# EAGLE design module (EAGLE 9.6.2)

## Sheet 1 of 3
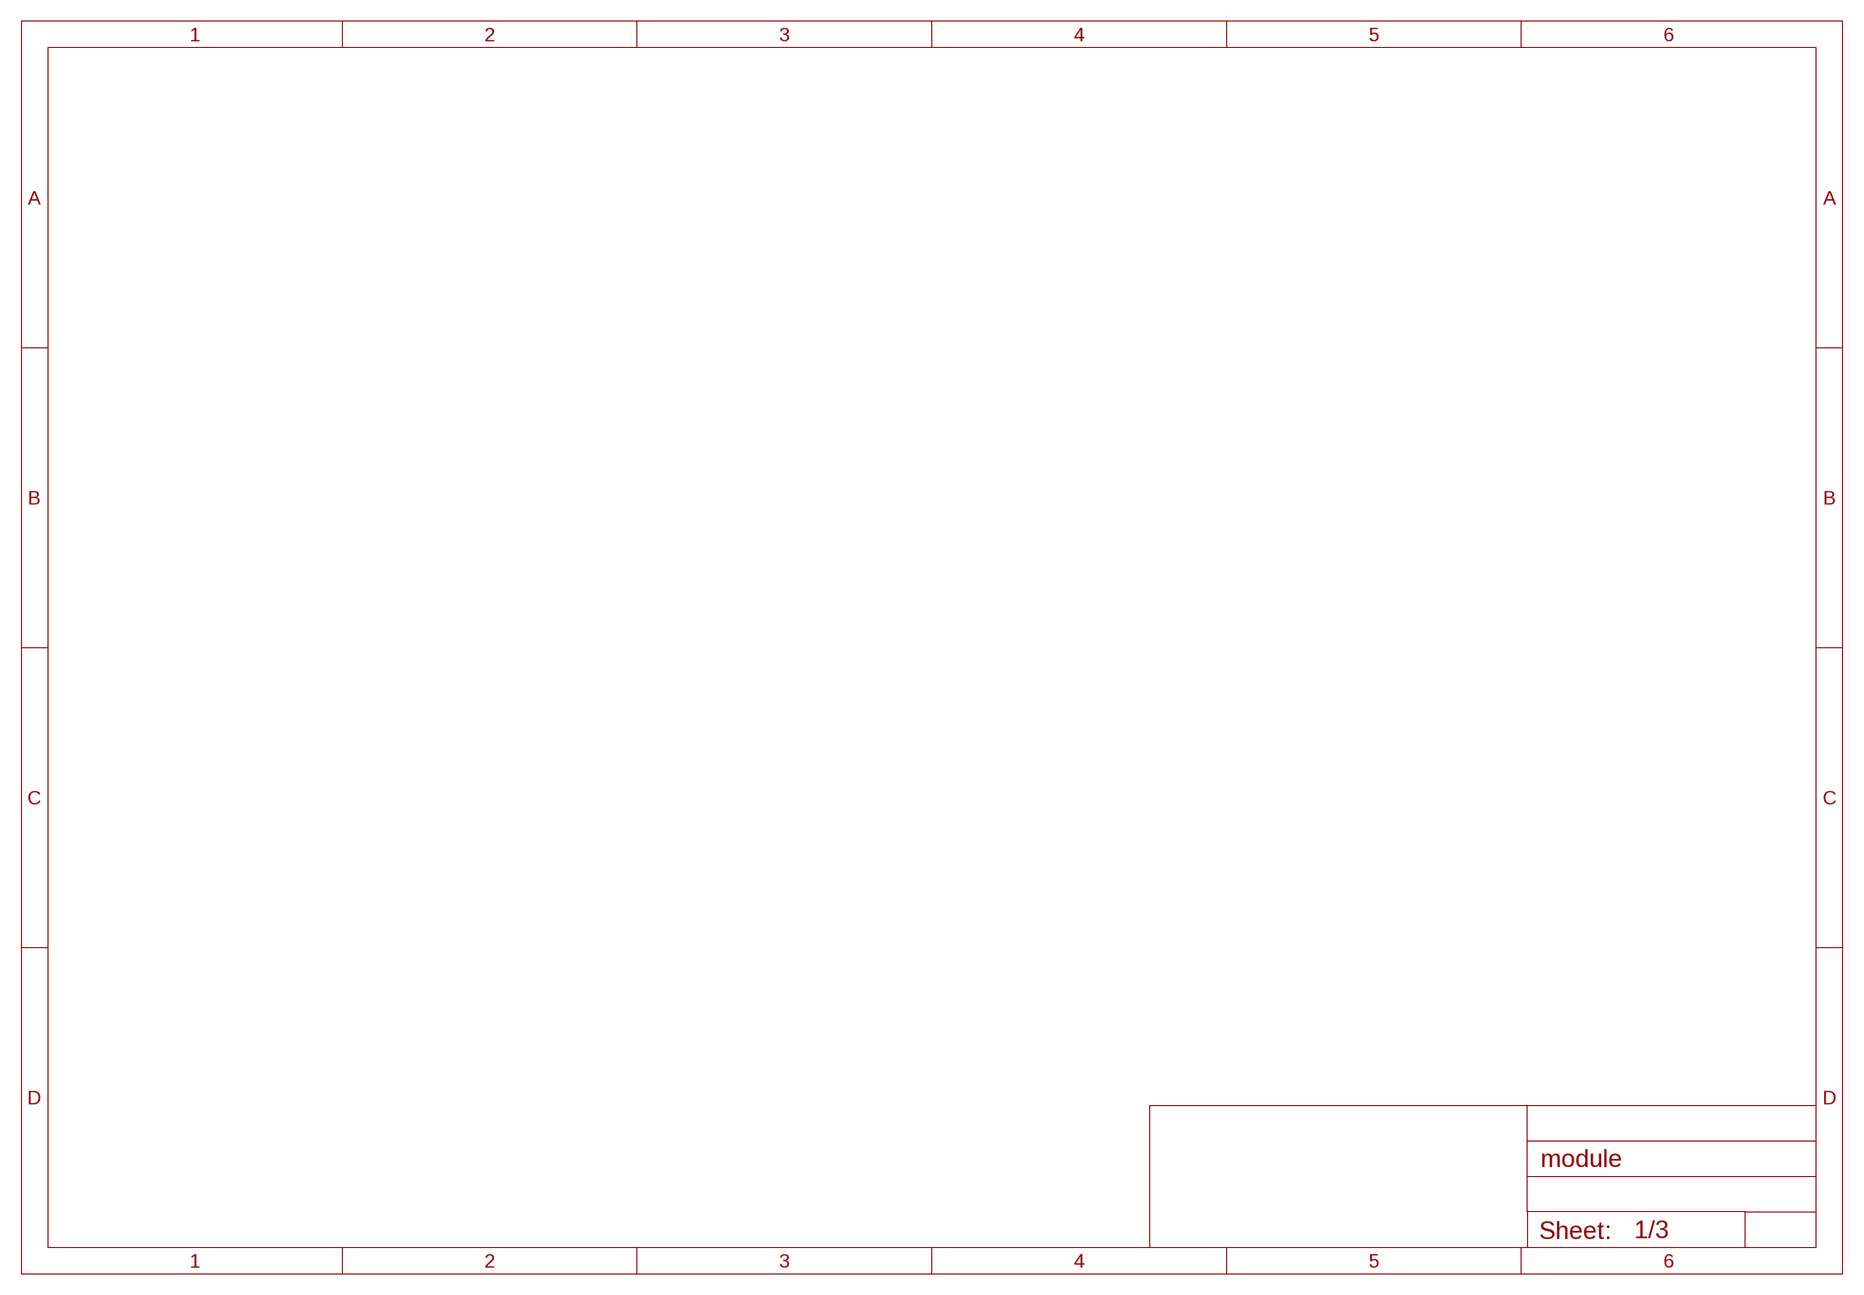
[diagram p0: schematic, sheet 1]

## Sheet 2 of 3
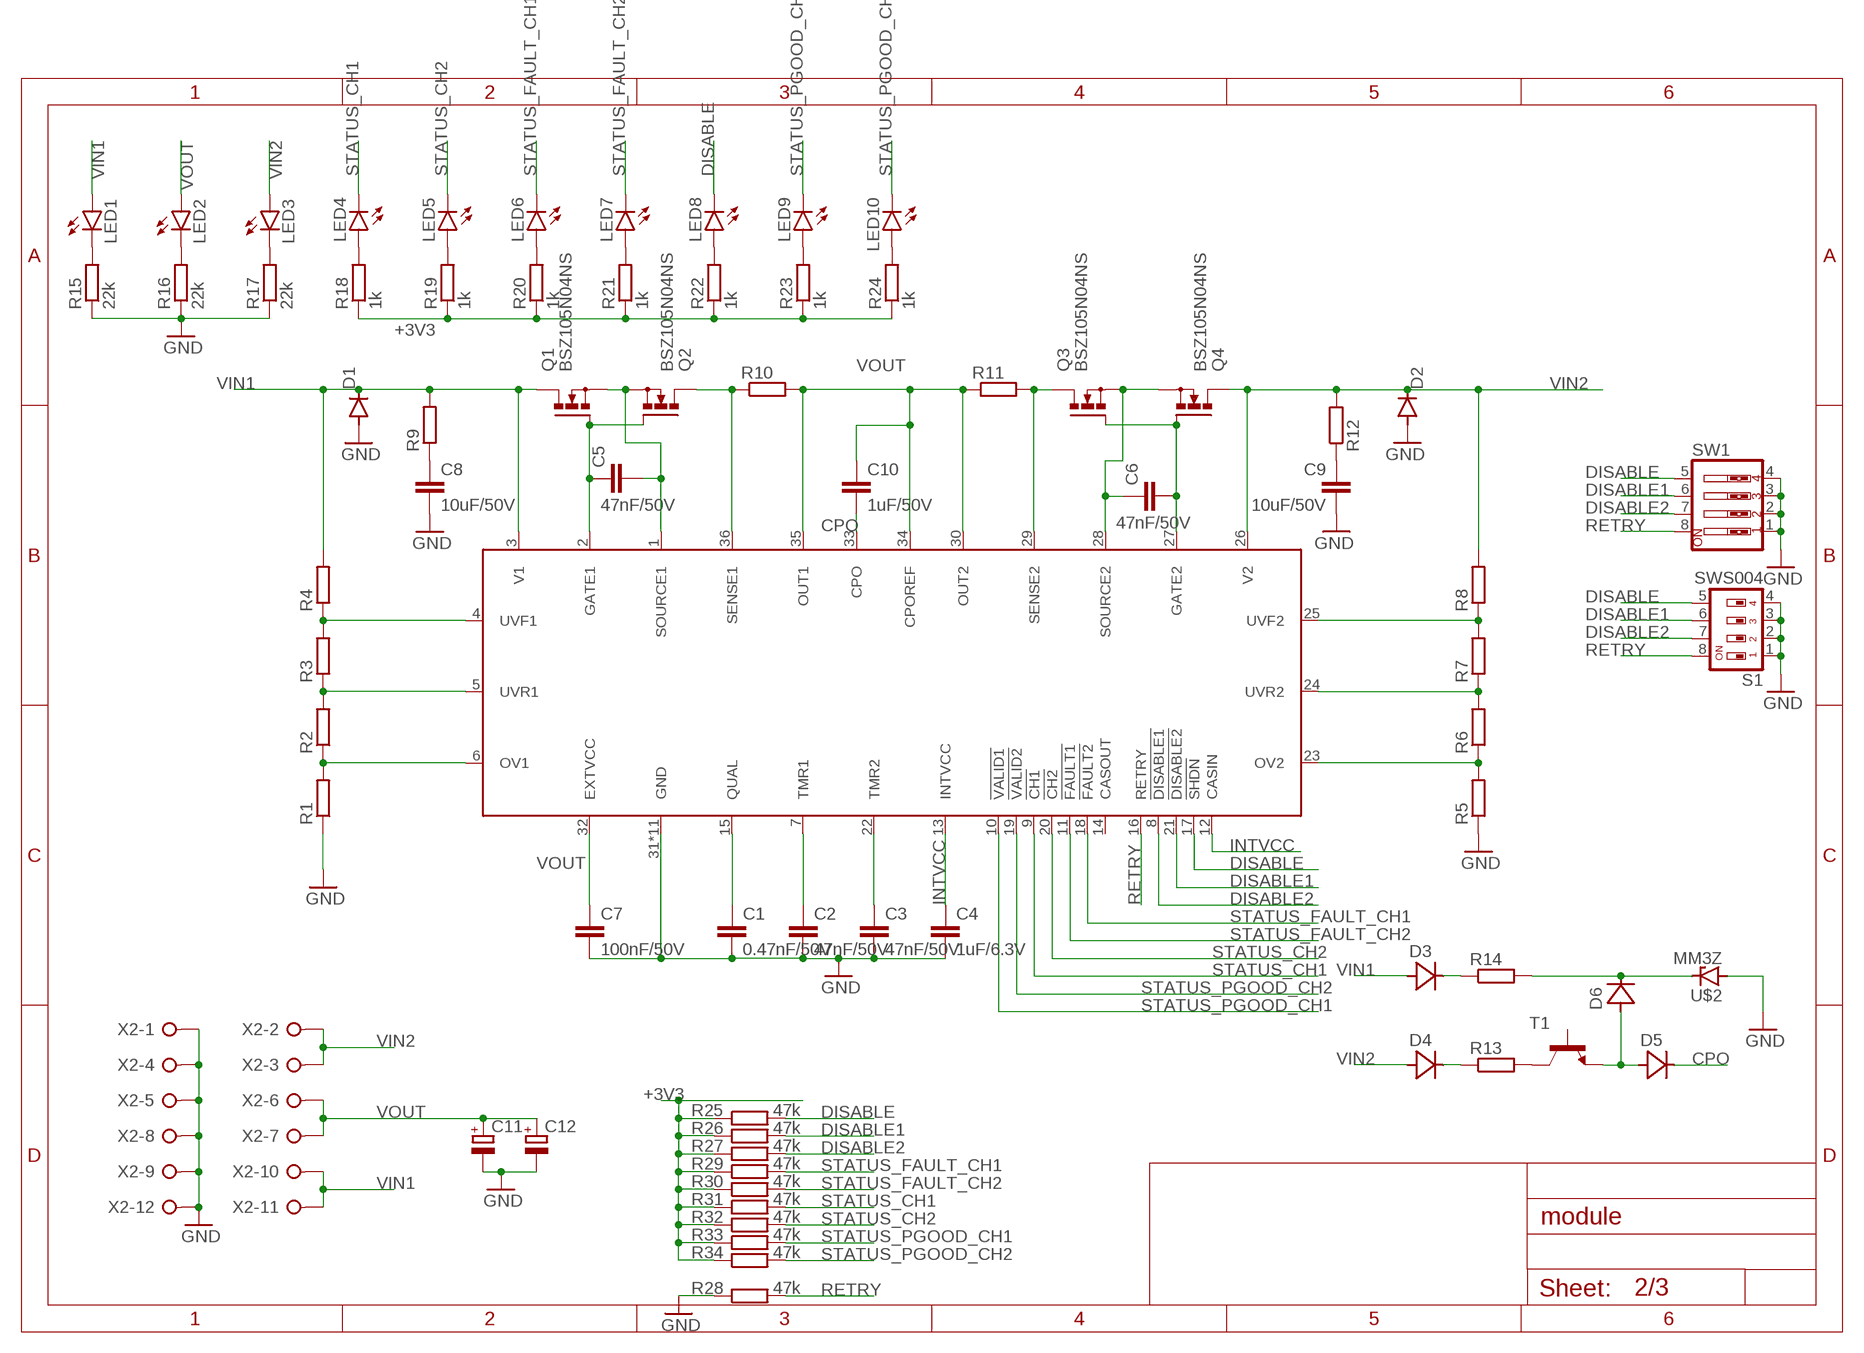
[diagram p1: schematic, sheet 2]

### Parts
C1  0.47nF/50V  C-EUC0603  [C0603]
C2  47nF/50V  C-EUC0603  [C0603]
C3  47nF/50V  C-EUC0603  [C0603]
C4  1uF/6.3V  C-EUC0603  [C0603]
C5  47nF/50V  C-EUC0603  [C0603]
C6  47nF/50V  C-EUC0603  [C0603]
C7  100nF/50V  C-EUC0603  [C0603]
C8  10uF/50V  C-EUC1206  [C1206]
C9  10uF/50V  C-EUC1206  [C1206]
C10  1uF/50V  C-EUC0805  [C0805]
C11  CPOL-EU140CLH-1010  [140CLH-1010]
C12  CPOL-EU140CLH-1010  [140CLH-1010]
D1  DIODE-DO214AC  [DO214AC]
D2  DIODE-DO214AC  [DO214AC]
D3  1N4148WS  [SOD323]
D4  1N4148WS  [SOD323]
D5  1N4148WS  [SOD323]
D6  1N4148WS  [SOD323]
LED1  LEDCHIP-LED0603  [CHIP-LED0603]
LED2  LEDCHIP-LED0603  [CHIP-LED0603]
LED3  LEDCHIP-LED0603  [CHIP-LED0603]
LED4  LEDCHIP-LED0603  [CHIP-LED0603]
LED5  LEDCHIP-LED0603  [CHIP-LED0603]
LED6  LEDCHIP-LED0603  [CHIP-LED0603]
LED7  LEDCHIP-LED0603  [CHIP-LED0603]
LED8  LEDCHIP-LED0603  [CHIP-LED0603]
LED9  LEDCHIP-LED0603  [CHIP-LED0603]
LED10  LEDCHIP-LED0603  [CHIP-LED0603]
Q1  BSZ105N04NS  [PG-TDSON-8]
Q2  BSZ105N04NS  [PG-TDSON-8]
Q3  BSZ105N04NS  [PG-TDSON-8]
Q4  BSZ105N04NS  [PG-TDSON-8]
R1  R-EU_R0603  [R0603]
R2  R-EU_R0603  [R0603]
R3  R-EU_R0603  [R0603]
R4  R-EU_R0603  [R0603]
R5  R-EU_R0603  [R0603]
R6  R-EU_R0603  [R0603]
R7  R-EU_R0603  [R0603]
R8  R-EU_R0603  [R0603]
R9  R-EU_R0603  [R0603]
R10  R-EU_R2512  [R2512]
R11  R-EU_R2512  [R2512]
R12  R-EU_R0603  [R0603]
R13  R-EU_R0603  [R0603]
R14  R-EU_R0603  [R0603]
R15  22k  R-EU_R0603  [R0603]
R16  22k  R-EU_R0603  [R0603]
R17  22k  R-EU_R0603  [R0603]
R18  1k  R-EU_R0603  [R0603]
R19  1k  R-EU_R0603  [R0603]
R20  1k  R-EU_R0603  [R0603]
R21  1k  R-EU_R0603  [R0603]
R22  1k  R-EU_R0603  [R0603]
R23  1k  R-EU_R0603  [R0603]
R24  1k  R-EU_R0603  [R0603]
R25  47k  R-EU_R0603  [R0603]
R26  47k  R-EU_R0603  [R0603]
R27  47k  R-EU_R0603  [R0603]
R28  47k  R-EU_R0603  [R0603]
R29  47k  R-EU_R0603  [R0603]
R30  47k  R-EU_R0603  [R0603]
R31  47k  R-EU_R0603  [R0603]
R32  47k  R-EU_R0603  [R0603]
R33  47k  R-EU_R0603  [R0603]
R34  47k  R-EU_R0603  [R0603]
S1  SWS004  [SMS-004]
SW1  SW_DIP-4  [EDG-04]
T1  MMBT2222ALT1-NPN-SOT23-BEC  [SOT23-BEC]
U$1  LTC4421  [QFN50P600X500X75-37T460X360N]
U$2  MM3Z  [SOD323]
X2  W237-12P  [W237-12P]

### Nets
+3V3: R18.1 R19.1 R20.1 R21.1 R22.1 R23.1 R24.1 R25.1 R26.1 R27.1 R29.1 R30.1 R31.1 R32.1 R33.1 R34.1
CPO: C10.2 D5.K(C) U$1.33(CPO)
DISABLE: LED8.C R25.2 S1.5 SW1.5 U$1.17(!SHDN)
DISABLE1: R26.2 S1.6 SW1.6 U$1.21(!DISABLE2)
DISABLE2: R27.2 S1.7 SW1.7 U$1.8(!DISABLE1)
GND: C1.2 C2.2 C3.2 C4.2 C7.2 C8.2 C9.2 C11.- C12.- D1.A D2.A R1.1 R5.1 R15.1 R16.1 R17.1 R28.1 S1.1 S1.2 S1.3 S1.4 SW1.1 SW1.2 SW1.3 SW1.4 U$1.31(GND) U$1.37(GND) U$1.P$1(GND) U$1.P$2(GND) U$1.P$3(GND) U$1.P$4(GND) U$1.P$5(GND) U$1.P$6(GND) U$1.P$7(GND) U$1.P$8(GND) U$1.P$9(GND) U$2.A X2.1 X2.4 X2.5 X2.8 X2.9 X2.12
INTVCC: C4.1 U$1.12(CASIN) U$1.13(INTVCC)
N$1: R1.2 R2.1 U$1.6(OV1)
N$2: R2.2 R3.1 U$1.5(UVR1)
N$3: R3.2 R4.1 U$1.4(UVF1)
N$4: R5.2 R6.1 U$1.23(OV2)
N$5: R6.2 R7.1 U$1.24(UVR2)
N$6: R7.2 R8.1 U$1.25(UVF2)
N$7: C5.1 Q1.4(G) Q2.4(G) U$1.2(GATE1)
N$8: C5.2 Q1.1(S) Q1.2(S) Q1.3(S) Q2.1(S) Q2.2(S) Q2.3(S) U$1.1(SOURCE1)
N$9: Q2.5(D) Q2.6(D) Q2.7(D) Q2.8(D) Q2.TH(D) R10.1 U$1.36(SENSE1)
N$10: C8.1 R9.1
N$11: C9.1 R12.1
N$12: D4.K(C) R13.1
N$13: C1.1 U$1.15(QUAL)
N$14: Q3.5(D) Q3.6(D) Q3.7(D) Q3.8(D) Q3.TH(D) R11.2 U$1.29(SENSE2)
N$15: C6.2 Q3.4(G) Q4.4(G) U$1.27(GATE2)
N$16: C6.1 Q3.1(S) Q3.2(S) Q3.3(S) Q4.1(S) Q4.2(S) Q4.3(S) U$1.28(SOURCE2)
N$17: D3.K(C) R14.1
N$18: C2.1 U$1.7(TMR1)
N$19: C3.1 U$1.22(TMR2)
N$21: R13.2 T1.C
N$22: D6.K(C) R14.2 U$2.K
N$23: D5.A D6.A T1.E
N$24: LED1.C R15.2
N$25: LED2.C R16.2
N$26: LED3.C R17.2
N$27: LED4.A R18.2
N$28: LED5.A R19.2
N$29: LED6.A R20.2
N$30: LED7.A R21.2
N$31: LED8.A R22.2
N$32: LED9.A R23.2
N$34: LED10.A R24.2
RETRY: R28.2 S1.8 SW1.8 U$1.16(RETRY)
STATUS_CH1: LED4.C R31.2 U$1.9(!CH1)
STATUS_CH2: LED5.C R32.2 U$1.20(!CH2)
STATUS_FAULT_CH1: LED6.C R29.2 U$1.18(!FAULT2)
STATUS_FAULT_CH2: LED7.C R30.2 U$1.11(!FAULT1)
STATUS_PGOOD_CH1: LED9.C R33.2 U$1.10(!VALID1)
STATUS_PGOOD_CH2: LED10.C R34.2 U$1.19(!VALID2)
VIN1: D1.C D3.A LED1.A Q1.5(D) Q1.6(D) Q1.7(D) Q1.8(D) Q1.TH(D) R4.2 R9.2 U$1.3(V1) X2.10 X2.11
VIN2: D2.C D4.A LED3.A Q4.5(D) Q4.6(D) Q4.7(D) Q4.8(D) Q4.TH(D) R8.2 R12.2 U$1.26(V2) X2.2 X2.3
VOUT: C7.1 C10.1 C11.+ C12.+ LED2.A R10.2 R11.1 U$1.30(OUT2) U$1.32(EXTVCC) U$1.34(CPOREF) U$1.35(OUT1) X2.6 X2.7
Unconnected: T1.B U$1.14(CASOUT)

## Sheet 3 of 3
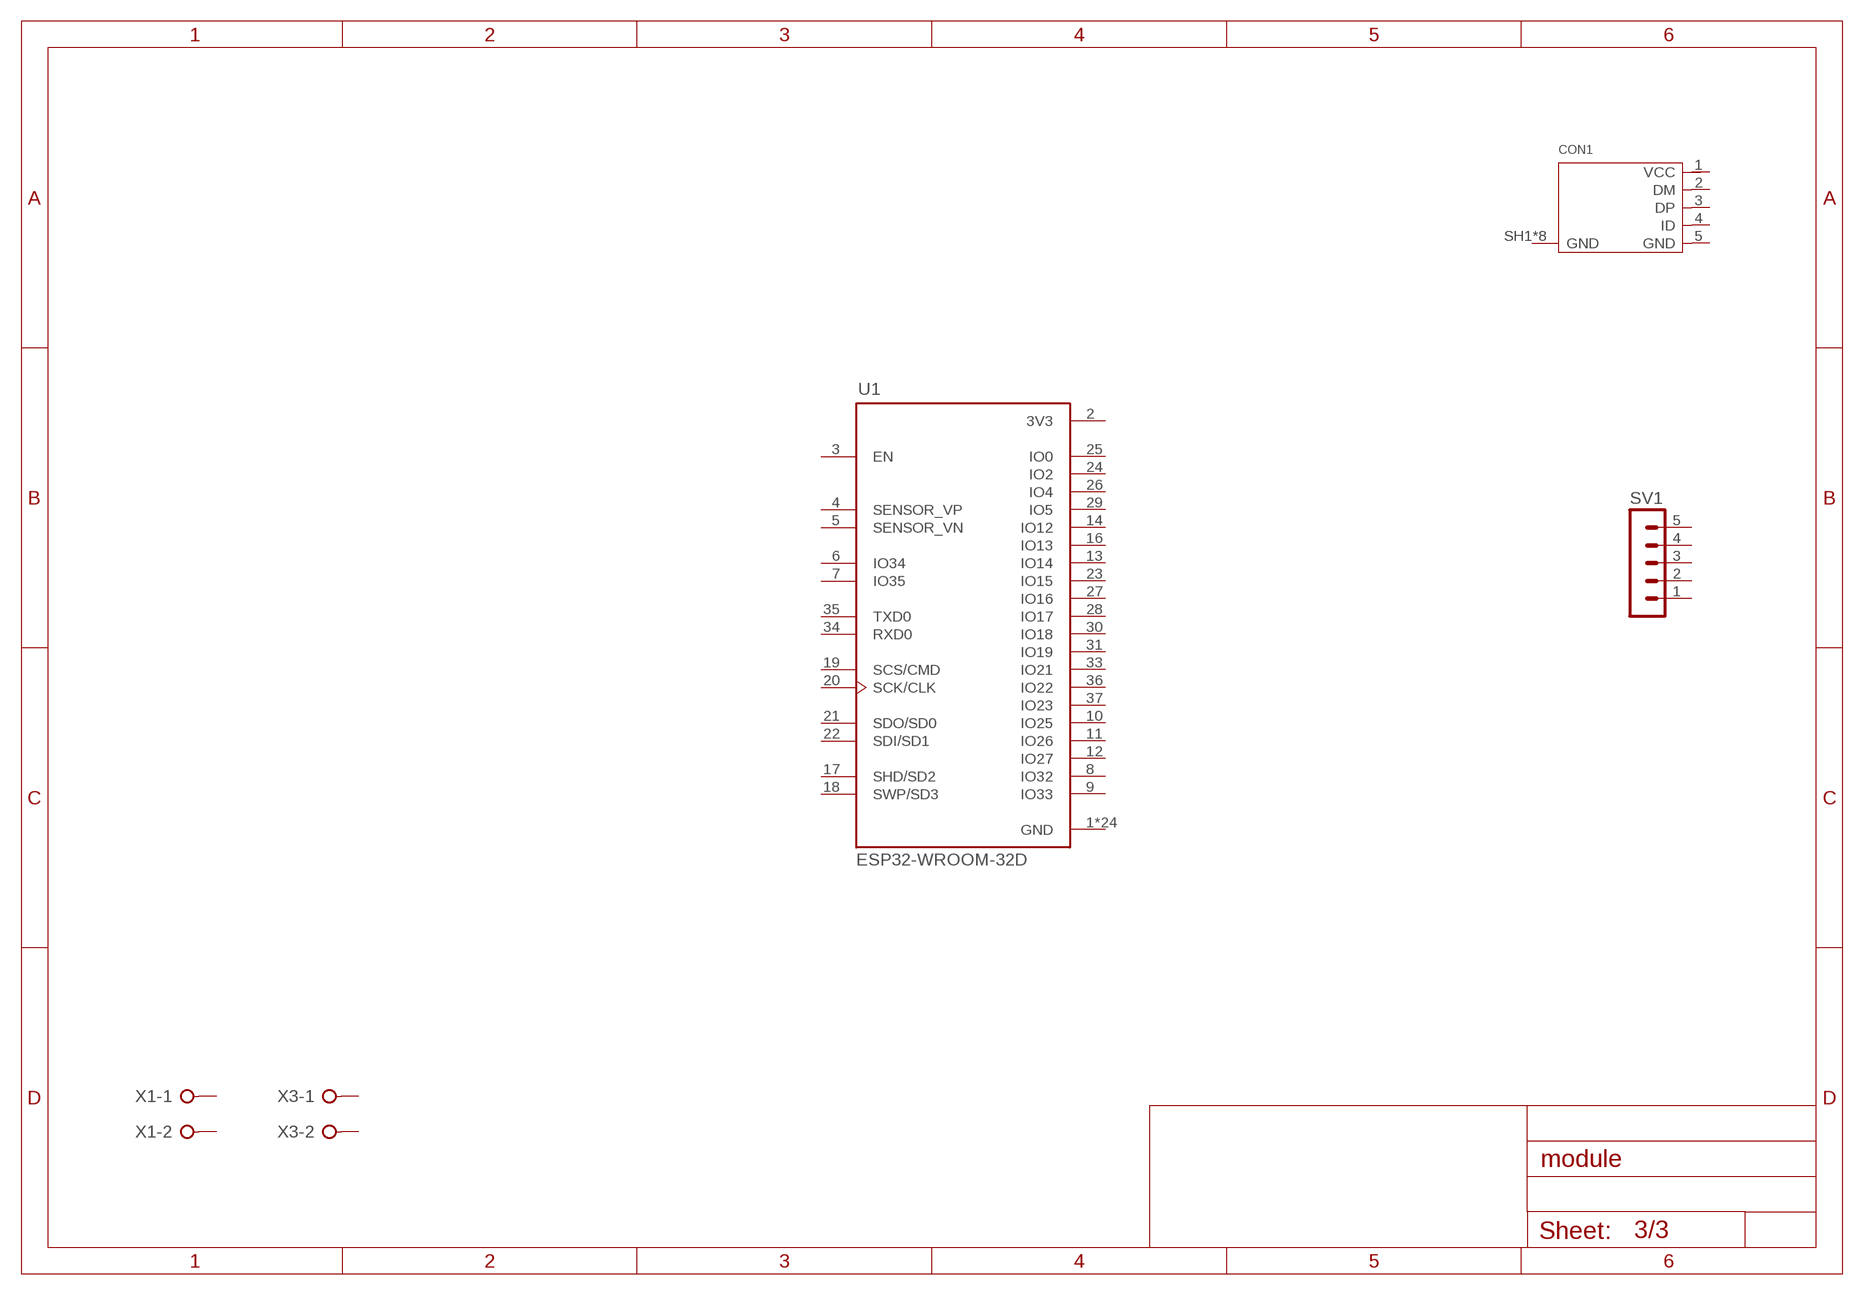
[diagram p2: schematic, sheet 3]

### Parts
CON1  10118194-0001LF  [10118194]
SV1  MA05-1  [MA05-1]
U1  ESP32-WROOM-32D  [MODULE_ESP32-WROOM-32D]
X1  W237-02P  [W237-132]
X3  W237-02P  [W237-132]
Unconnected: CON1.1(VCC) CON1.2(DM) CON1.3(DP) CON1.4(ID) CON1.5(GND) CON1.SH1(GND) CON1.SH2(GND) CON1.SH3(GND) CON1.SH4(GND) CON1.SH5(GND) CON1.SH6(GND) CON1.SH7(GND) CON1.SH8(GND) SV1.1 SV1.2 SV1.3 SV1.4 SV1.5 U1.3(EN) U1.4(SENSOR_VP) U1.5(SENSOR_VN) U1.6(IO34) U1.7(IO35) U1.8(IO32) U1.9(IO33) U1.10(IO25) U1.11(IO26) U1.12(IO27) U1.13(IO14) U1.14(IO12) U1.16(IO13) U1.17(SHD/SD2) U1.18(SWP/SD3) U1.19(SCS/CMD) U1.20(SCK/CLK) U1.21(SDO/SD0) U1.22(SDI/SD1) U1.23(IO15) U1.24(IO2) U1.25(IO0) U1.26(IO4) U1.27(IO16) U1.28(IO17) U1.29(IO5) U1.30(IO18) U1.31(IO19) U1.33(IO21) U1.34(RXD0) U1.35(TXD0) U1.36(IO22) U1.37(IO23) X1.1 X1.2 X3.1 X3.2

## Power pins joined to a net without a drawn wire
3V3: U1.2(3V3)
GND: U1.1(GND) U1.15(GND) U1.38(GND) U1.39_1(GND) U1.39_2(GND) U1.39_3(GND) U1.39_4(GND) U1.39_5(GND) U1.39_6(GND) U1.39_7(GND) U1.39_8(GND) U1.39_9(GND) U1.39_10(GND) U1.39_11(GND) U1.39_12(GND) U1.39_13(GND) U1.39_14(GND) U1.39_15(GND) U1.39_16(GND) U1.39_17(GND) U1.39_18(GND) U1.39_19(GND) U1.39_20(GND) U1.39_21(GND)

## Library data of the parts
C1-C10 = rcl:C-EU: CAPACITOR, European symbol; SPICEPREFIX: C
C11 C12 = rcl:CPOL-EU: POLARIZED CAPACITOR, European symbol; SPICEPREFIX: C
CON1 = parts-amphenol:10118194-00
D1 D2 = diode:DIODE-: DIODE
D3-D6 = parts-diotec:1N4148WS
LED1-LED10 = led:LED: LED OSRAM: - CHIPLED LG R971, LG N971, LY N971, LG Q971, LY Q971, LO R971, LY R971 LH N974, LH R974 LS Q976, LO Q976, LY Q976 LO Q996 - Hyper CHIPLED LW Q18S LB Q993, LB Q99A, LB R99A - SideLED LS A670, LO A670, LY A670, LG A670, LP A670 LB A673, LV A673, LT A673, LW A673 LH A674 LY A675 LS A676, LA A676, LO A676, LY A676, LW A676 LS A679, LY A679, LG A679 - Hyper Micro SIDELED® LS Y876, LA Y876, LO Y876, LY Y876 LT Y87S - SmartLED LW L88C, LW L88S LB L89C, LB L89S, LG L890 LS L89K, LO L89K, LY L89K LS L896, LA L896, LO L896, LY L896 - TOPLED LS T670, LO T670, LY T670, LG T670, LP T670 LSG T670, LSP T670, LSY T670, LOP T670, LYG T670 LG T671, LOG T671, LSG T671 LB T673, LV T673, LT T673, LW T673 LH T674 LS T676, LA T676, LO T676, LY T676, LB T676, LH T676, LSB T676, LW T676 LB T67C, LV T67C, LT T67C, LS T67K, LO T67K, LY T67K, LW E67C LS E67B, LA E67B, LO E67B, LY E67B, LB E67C, LV E67C, LT E67C LW T67C LS T679, LY T679, LG T679 LS T770, LO T770, LY T770, LG T770, LP T770 LB T773, LV T773, LT T773, LW T773 LH T774 LS E675, LA E675, LY E675, LS T675 LS T776, LA T776, LO T776, LY T776, LB T776 LHGB T686 LT T68C, LB T68C - Hyper Mini TOPLED® LB M676 - Mini TOPLED Santana® LG M470 LS M47K, LO M47K, LY M47K Source: http://www.osram.convergy.de LUXEON: - LUMILED® LXK2-PW12-R00, LXK2-PW12-S00, LXK2-PW14-U00, LXK2-PW14-V00 LXK2-PM12-R00, LXK2-PM12-S00, LXK2-PM14-U00 LXK2-PE12-Q00, LXK2-PE12-R00, LXK2-PE12-S00, LXK2-PE14-T00, LXK2-PE14-U00 LXK2-PB12-K00, LXK2-PB12-L00, LXK2-PB12-M00, LXK2-PB14-N00, LXK2-PB14-P00, LXK2-PB14-Q00 LXK2-PR12-L00, LXK2-PR12-M00, LXK2-PR14-Q00, LXK2-PR14-R00 LXK2-PD12-Q00, LXK2-PD12-R00, LXK2-PD12-S00 LXK2-PH12-R00, LXK2-PH12-S00 LXK2-PL12-P00, LXK2-PL12-Q00, LXK2-PL12-R00 Source: www.luxeon.com KINGBRIGHT: KA-3528ASYC Source: www.kingbright.com
Q1-Q4 = transistor-power:BSZ105N04NS: OptiMOS (TM)3 Power-Transistor N-Channel, Normal level Source : Data sheet <http://www.infineon.com/dgdl/BSZ105N04NSG_rev1.1.pdf?folderId=db3a3043156fd5730115c7d50620107c&fileId=db3a30431689f4420116c485c67f084e>
R1-R34 = rcl:R-EU_: RESISTOR, European symbol; SPICEPREFIX: R
S1 = smd-special:SWS004: SMD Dip Switch 4 pol.
SV1 = parts-passives:MA05-1: PIN HEADER; OC_FARNELL: unknown; OC_NEWARK: unknown
SW1 = special:SW_DIP-4: DIP SWITCH
T1 = transistor-neu-to92:*-NPN-: NPN Transistror
U1 = parts-espressif:ESP32-WROOM-32D: Bluetooth, WiFi 802.11b/g/n, Bluetooth v4.2 + EDR, Class 1, 2 and 3 Transceiver Module 2.4GHz ~ 2.5GHz Integrated, Trace Surface Mount Check prices <https://pricing.snapeda.com/parts/ESP32-WROOM-32D/Espressif%20Systems/view-part?ref=eda>; AVAILABILITY: Bad; DESCRIPTION: 802.11b/g/n, Bluetooth v4.2 +EDR, Class 1, 2 and 3 Transceiver Module 2.4GHz ~ 2.5GHz Integrated, Trace Surface Mount; MF: Espressif Systems; MP: ESP32-WROOM-32D; PACKAGE: Module Espressif Systems; PRICE: None
U$1 = parts-analog_dev:LTC4421
U$2 = parts-onsemi:MM3Z
X1 X3 = con-wago-508:W237-02P: WAGO SREW CLAMP; OC_FARNELL: unknown; OC_NEWARK: unknown
X2 = con-wago-508:W237-12P: WAGO SREW CLAMP; OC_FARNELL: unknown; OC_NEWARK: unknown

## Board
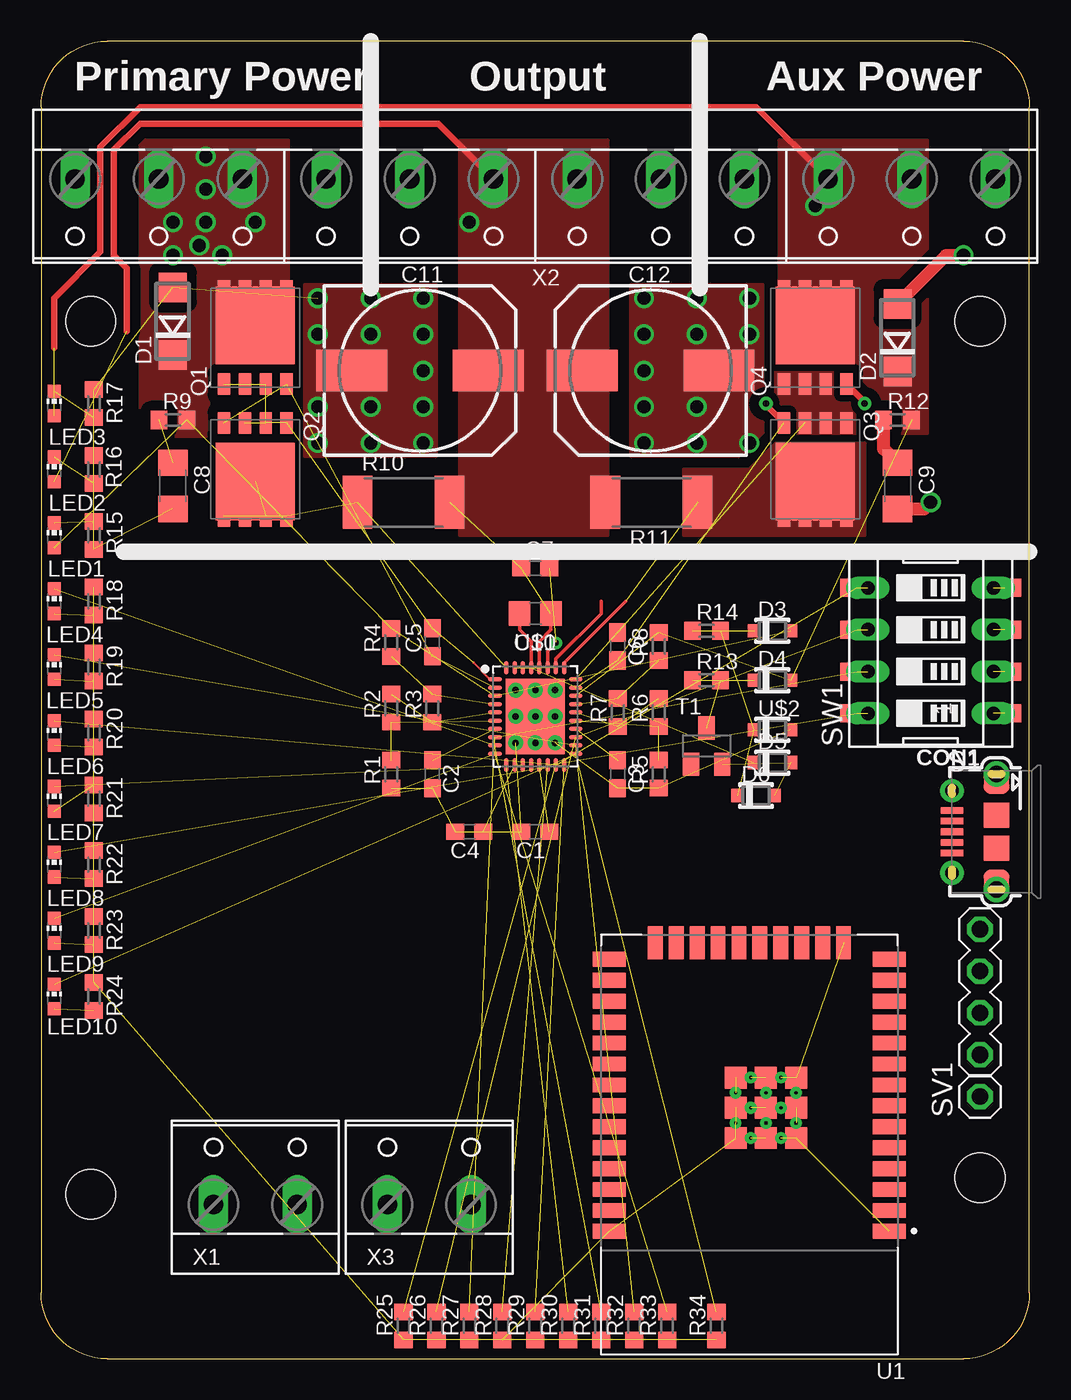
[diagram p3: board, top side]
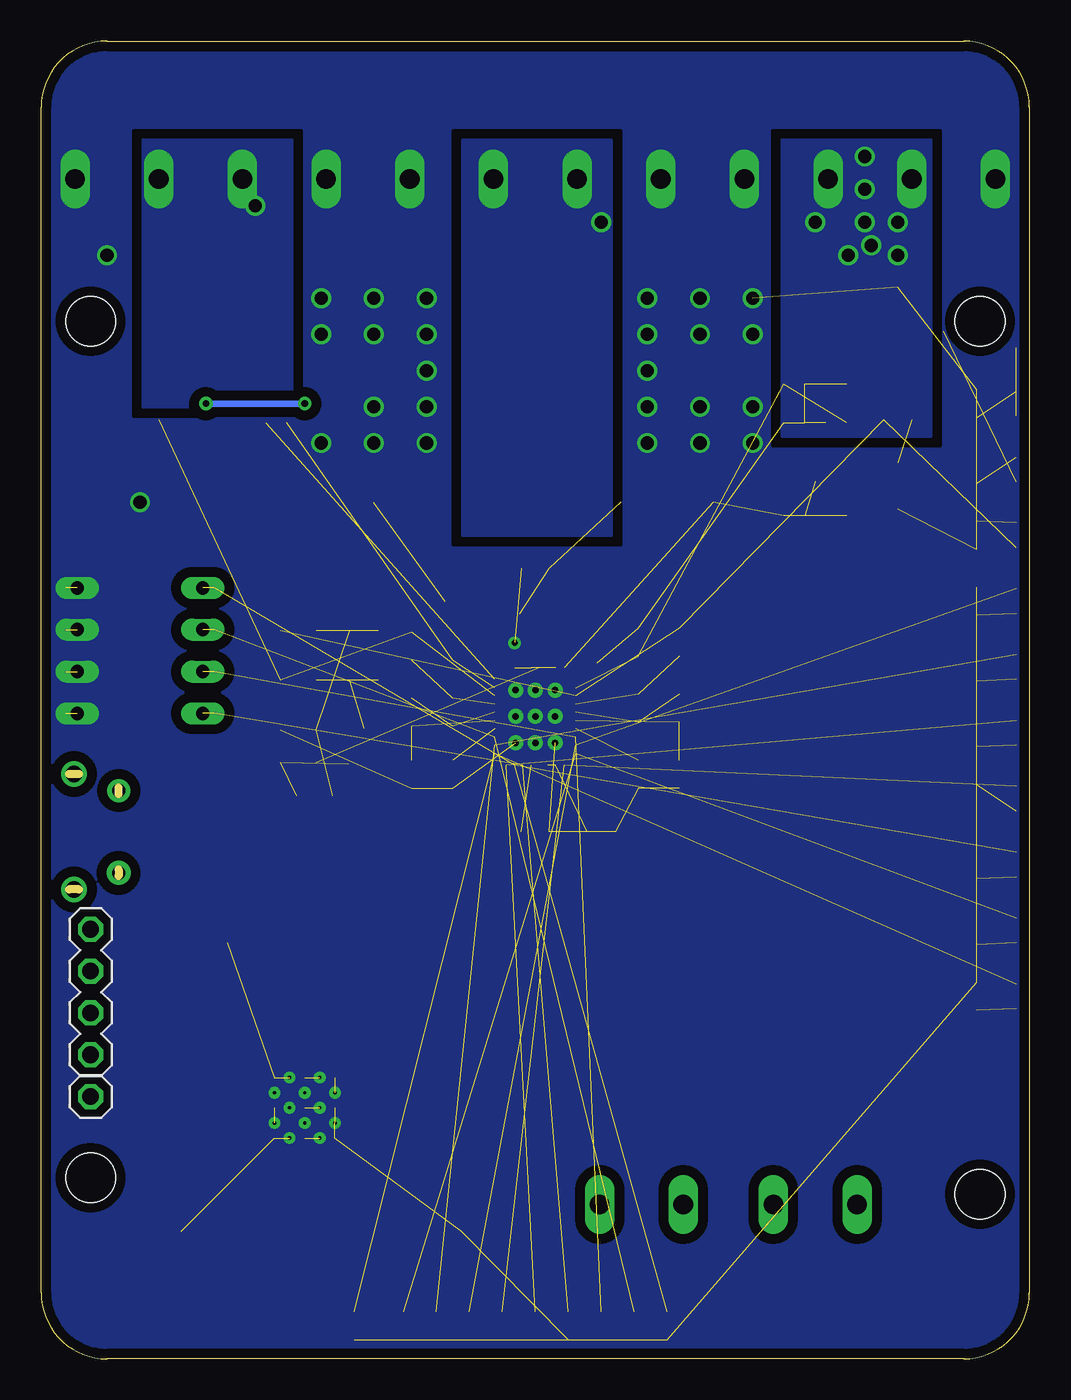
[diagram p4: board, bottom side, seen from below]

Size 60 x 80 mm. Coordinates in mm from the lower left corner, seen from the top.
Outline: 4,0 56,0 arc90 60,4 60,76 arc90 56,80 4,80 arc90 0,76 0,4 arc90 4,0
Copper layers (1*16): Top 0.035mm / dielectric 1.5mm / Bottom 0.035mm
Design rules "default *": minimum track width 6mil, minimum drill 0.2mm, track to track 6mil, track to pad 6mil, pad to pad 6mil, via to via 6mil, smd to smd 6mil, copper to edge 0.5mm, drill to drill 6mil, minimum pad ring 10mil, minimum via ring 8mil, stop-mask expansion 4mil, vias tented up to drill 0mil, thermal gap 10mil
Holes 3 mm at 3,63 57,63 3,10 57,11
tKeepout: area 54,60 to 60,66; area 54,8 to 60,14; area 0,7 to 6,13; area 0,60 to 6,66

### Footprints (pad centres in the part's own frame; a part is rotated, then mirrored left to right if it is on the bottom)
C0603 = smd 1.1 x 1: 1 -0.85,0; 2 0.85,0
C1206 = smd 1.6 x 1.8: 1 -1.4,0; 2 1.4,0
C0805 = smd 1.3 x 1.5: 1 -0.95,0; 2 0.95,0
140CLH-1010 = smd 4.3 x 2.5: + 4.15,0; - -4.15,0
10118194 = smd 0.4 x 1.35: 1 -1.3,2.7; 2 -0.65,2.7; 3 0,2.7; 4 0.65,2.7; 5 1.3,2.7 | drill 0.8 pad 1.45: SH1 -2.5,2.7 | drill 0.8 pad 1.4: SH2 2.5,2.7 | drill 1 pad 1.55: SH3 -3.5,0; SH8 3.5,0 | smd 1.5 x 1.55: SH4 -3.05,0; SH5 -1,0; SH6 1,0; SH7 3.05,0
DO214AC = smd 1.8 x 1.7: A 2.05,0; C -2.05,0
SOD323 = smd 0.8 x 0.8: A 1.1,0; K -1.1,0
CHIP-LED0603 = smd 0.8 x 0.8: A 0,-0.75; C 0,0.75
PG-TDSON-8 = smd 1.3 x 0.75: 1 -2.825,1.905; 2 -2.825,0.635; 3 -2.825,-0.635; 4 -2.825,-1.905; 5 2.825,-1.905; 6 2.825,-0.635; 7 2.825,0.635; 8 2.825,1.905 | smd 4.7 x 4.8: TH 0.725,0
R0603 = smd 1 x 1.1: 1 -0.85,0; 2 0.85,0
R2512 = smd 1.8 x 3.2: 1 -2.8,0; 2 2.8,0
SMS-004 = smd 1.092 x 2.007: 1 -3.81,-4.496; 2 -1.27,-4.496; 3 1.27,-4.496; 4 3.81,-4.496; 5 3.81,4.496; 6 1.27,4.496; 7 -1.27,4.496; 8 -3.81,4.496
MA05-1 = drill 1.016 pad 1.5 octagon: 1 -5.08,0; 2 -2.54,0; 3 0,0; 4 2.54,0; 5 5.08,0
EDG-04 = drill 0.813 long: 1 -3.81,-3.81; 2 -1.27,-3.81; 3 1.27,-3.81; 4 3.81,-3.81; 5 3.81,3.81; 6 1.27,3.81; 7 -1.27,3.81; 8 -3.81,3.81
SOT23-BEC = smd 1 x 1.4: B -0.95,-1.1; C 0,1.1; E 0.95,-1.1
MODULE_ESP32-WROOM-32D = smd 2 x 0.9: 1 -8.5,5.26; 2 -8.5,3.99; 3 -8.5,2.72; 4 -8.5,1.45; 5 -8.5,0.18; 6 -8.5,-1.09; 7 -8.5,-2.36; 8 -8.5,-3.63; 9 -8.5,-4.9; 10 -8.5,-6.17; 11 -8.5,-7.44; 12 -8.5,-8.71; 13 -8.5,-9.98; 14 -8.5,-11.25; 25 8.5,-11.25; 26 8.5,-9.98; 27 8.5,-8.71; 28 8.5,-7.44; 29 8.5,-6.17; 30 8.5,-4.9; 31 8.5,-3.63; 32 8.5,-2.36; 33 8.5,-1.09; 34 8.5,0.18; 35 8.5,1.45; 36 8.5,2.72; 37 8.5,3.99; 38 8.5,5.26 | smd 0.9 x 2: 15 -5.715,-12.25; 16 -4.445,-12.25; 17 -3.175,-12.25; 18 -1.905,-12.25; 19 -0.635,-12.25; 20 0.635,-12.25; 21 1.905,-12.25; 22 3.175,-12.25; 23 4.445,-12.25; 24 5.715,-12.25 | smd 1.33 x 1.33: 39_1 -2.835,-0.405; 39_2 -1,-0.405; 39_3 0.835,-0.405; 39_4 -2.835,-2.24; 39_5 -1,-2.24; 39_6 0.835,-2.24; 39_7 -2.835,-4.075; 39_8 -1,-4.075; 39_9 0.835,-4.075 | drill 0.2 pad 0.3: 39_10 -1.917,-0.405; 39_11 -0.083,-0.405; 39_12 -2.835,-1.323; 39_13 -1,-1.323; 39_14 0.835,-1.323; 39_15 -1.917,-2.24; 39_16 -0.083,-2.24; 39_17 -2.835,-3.158; 39_18 -1,-3.158; 39_19 0.835,-3.158; 39_20 -1.917,-4.075; 39_21 -0.083,-4.075
QFN50P600X500X75-37T460X360N = smd 0.83 x 0.27: 1 -2.45,2.25; 2 -2.45,1.75; 3 -2.45,1.25; 4 -2.45,0.75; 5 -2.45,0.25; 6 -2.45,-0.25; 7 -2.45,-0.75; 8 -2.45,-1.25; 9 -2.45,-1.75; 10 -2.45,-2.25; 19 2.45,-2.25; 20 2.45,-1.75; 21 2.45,-1.25; 22 2.45,-0.75; 23 2.45,-0.25; 24 2.45,0.25; 25 2.45,0.75; 26 2.45,1.25; 27 2.45,1.75; 28 2.45,2.25 | smd 0.27 x 0.83: 11 -1.75,-2.95; 12 -1.25,-2.95; 13 -0.75,-2.95; 14 -0.25,-2.95; 15 0.25,-2.95; 16 0.75,-2.95; 17 1.25,-2.95; 18 1.75,-2.95; 29 1.75,2.95; 30 1.25,2.95; 31 0.75,2.95; 32 0.25,2.95; 33 -0.25,2.95; 34 -0.75,2.95; 35 -1.25,2.95; 36 -1.75,2.95 | smd 3.6 x 4.6: 37 0,0 | drill 0.4: P$1 -1.2,1.6; P$2 0,1.6; P$3 1.2,1.6; P$4 1.2,0; P$5 0,0; P$6 -1.2,0; P$7 -1.2,-1.6; P$8 0,-1.6; P$9 1.2,-1.6
W237-132 = drill 1.194 long: 1 -2.54,-0.635; 2 2.54,-0.635
W237-12P = drill 1.194 long: 1 -27.94,-0.635; 2 -22.86,-0.635; 3 -17.78,-0.635; 4 -12.7,-0.635; 5 -7.62,-0.635; 6 -2.54,-0.635; 7 2.54,-0.635; 8 7.62,-0.635; 9 12.7,-0.635; 10 17.78,-0.635; 11 22.86,-0.635; 12 27.94,-0.635

### Placement (x,y rotation side)
C1  30,32 180 top
C2  23.75,35.5 270 top
C3  35,35.5 270 top
C4  26,32 180 top
C5  23.75,43.5 90 top
C6  35,43.25 270 top
C7  30,48 0 top
C8  8,53 270 top
C9  52,53 270 top
C10  30,45.25 180 top
C11  23,60 0 top
C12  37,60 180 top
CON1  58,32 90 top
D1  8,63 90 top
D2  52,62 90 top
D3  44.4,44.2 0 top
D4  44.4,41.2 0 top
D5  44.4,36.2 0 top
D6  43.4,34.2 0 top
LED1  0.8,50 0 top
LED2  0.8,54 0 top
LED3  0.8,58 0 top
LED4  0.8,46 0 top
LED5  0.8,42 0 top
LED6  0.8,38 0 top
LED7  0.8,34 0 top
LED8  0.8,30 0 top
LED9  0.8,26 0 top
LED10  0.8,22 0 top
Q1  13,62 90 top
Q2  13,54 270 top
Q3  47,54 270 top
Q4  47,62 90 top
R1  21.25,35.5 90 top
R2  21.25,39.5 90 top
R3  23.75,39.5 90 top
R4  21.25,43.5 90 top
R5  37.5,35.5 90 top
R6  37.5,39.25 90 top
R7  35,39.25 90 top
R8  37.5,43.25 90 top
R9  8,57 0 top
R10  22,52 0 top
R11  37.05,52 0 top
R12  52,57 0 top
R13  40.4,41.2 0 top
R14  40.4,44.2 0 top
R15  3.2,50 90 top
R16  3.2,54 270 top
R17  3.2,58 270 top
R18  3.2,46 270 top
R19  3.2,42 270 top
R20  3.2,38 270 top
R21  3.2,34 90 top
R22  3.2,30 270 top
R23  3.2,26 270 top
R24  3.2,22 270 top
R25  22,2 90 top
R26  24,2 90 top
R27  26,2 90 top
R28  28,2 90 top
R29  30,2 90 top
R30  32,2 90 top
R31  34,2 90 top
R32  36,2 90 top
R33  38,2 90 top
R34  41,2 90 top
S1  54,43 90 top
SV1  57,21 90 top
SW1  54,43 90 top
T1  40.4,37.2 0 top
U1  43,13 180 top
U$1  30,39 0 top
U$2  44.4,38.2 0 top
X1  13,10 0 top
X2  30,71 180 top
X3  23.56,10 0 top

### Tracks (layer width: path | path; a pad name or v marks a point on that pad's centre or on a via)
+3V3  (15 unrouted)
CPO  (1 unrouted)
  Top 0.2: U$1.33 29.75,43.55 29.05,44.25 C10.2
DISABLE  (4 unrouted)
DISABLE1  (3 unrouted)
DISABLE2  (3 unrouted)
GND  (via drill 0.35, 0.8)  (30 unrouted)
  Top 0.2: v31.25,43.47 31.25,43.45 30.75,42.95 U$1.31
  Top 0.8: D2.A 54.95,67 v56,67 | C9.2 53.6,51.6 v54,52
  Bottom 0.2: v31.25,43.47 31.25,43.5
  other vias: 16.8,64.4 20,64.4 23.2,64.4 16.8,62.2 20,62.2 23.2,62.2 23.2,60 23.2,57.8 23.2,55.6 20,55.6 16.8,55.6 16.8,57.8 20,57.8 43,55.6 39.8,55.6 36.6,55.6 39.8,57.8 36.6,57.8 36.6,60 36.6,62.2 36.6,64.4 39.8,64.4 43,64.4 43,62.2 39.8,62.2
  pour Bottom (isolate 0.6, rank 6, no thermals): -1,-1 61,-1 61,81 -1,81
  pour Top (no thermals): 16,65.2 24,65.2 24,54.8 16,54.8
  pour Top (isolate 0.6, rank 6, no thermals): 43.8,54.8 35.8,54.8 35.8,65.2 43.8,65.2
INTVCC  (2 unrouted)
N$1  (2 unrouted)
N$2  (2 unrouted)
N$3  (2 unrouted)
N$4  (2 unrouted)
N$5  (2 unrouted)
N$6  (2 unrouted)
N$7  (3 unrouted)
N$8  (7 unrouted)
  Top 0.152: U$1.1 27.25,41.25 26.25,42.25
N$9  (6 unrouted)
N$10  (1 unrouted)
N$11
  Top 0.8: C9.1 51.15,55.25 R12.1
N$12  (1 unrouted)
N$13  (1 unrouted)
N$14  (1 unrouted)
  Top 0.2: U$1.29 31.75,42.25 35.5,46
  pour Top (isolate 0.4, no thermals): 39,54 43,54 44.6,55.6 50,55.6 50,50 39,50
N$15  (via drill 0.4)  (2 unrouted)
  Top 0.4: Q4.4 50,58.08 v50,58 | v44,58 44,57.92 Q3.4
  Bottom 0.4: v50,58 v44,58
N$16  (2 unrouted)
  pour Top (isolate 0.4, rank 2, no thermals): 44.6,60 49.4,60 49.4,56 44.6,56
N$17  (1 unrouted)
N$18  (1 unrouted)
N$19  (1 unrouted)
N$21  (1 unrouted)
N$22  (2 unrouted)
N$23  (2 unrouted)
N$24  (1 unrouted)
N$25  (1 unrouted)
N$26  (1 unrouted)
N$27  (1 unrouted)
N$28  (1 unrouted)
N$29  (1 unrouted)
N$30  (1 unrouted)
N$31  (1 unrouted)
N$32  (1 unrouted)
N$34  (1 unrouted)
RETRY  (3 unrouted)
STATUS_CH1  (2 unrouted)
STATUS_CH2  (2 unrouted)
STATUS_FAULT_CH1  (2 unrouted)
STATUS_FAULT_CH2  (2 unrouted)
STATUS_PGOOD_CH1  (2 unrouted)
STATUS_PGOOD_CH2  (2 unrouted)
VIN1  (via drill 0.8)  (4 unrouted)
  other vias: 9.6,67.6 13,69 8,67 10,69 11,67 10,71 10,73 8,69
  pour Top (isolate 0.6, no thermals): 6,74 15,74 15,56 6,56
  pour Bottom (no thermals): 6,74 15,74 15,56 6,56
VIN2  (via drill 0.8)  (4 unrouted)
  Top 0.4: X2.3 43.41,76 6,76 3.6,73.6 3.6,67.2 0.8,64.4 0.8,61.4
  other vias: 47,70
  pour Top (isolate 0.6, rank 3, no thermals): 44.8,74 53.8,74 53.8,56.2 44.8,56.2
  pour Bottom (isolate 0.6, no thermals): 44.8,74 53.8,74 53.8,57.8 44.8,57.8
VOUT  (via drill 0.8)  (6 unrouted)
  Top 0.2: U$1.30 31.25,42.5 34,45.25 34,46 | C10.1 30.95,44.25 30.25,43.55 U$1.32
  Top 0.4: X2.7 24.09,75 6,75 4.4,73.4 4.4,67 5.2,66.2 5.2,62.4
  other vias: 26,69
  pour Bottom (no thermals): 25.4,74 34.4,74 34.4,50 25.4,50
  pour Top (no thermals): 25.4,74 34.4,74 34.4,50 25.4,50

### Text on the board
tPlace: Primary Power | Output | Aux Power